# EAGLE design Routerv1.2 (EAGLE 8.3.1)

## Sheet 1 of 2
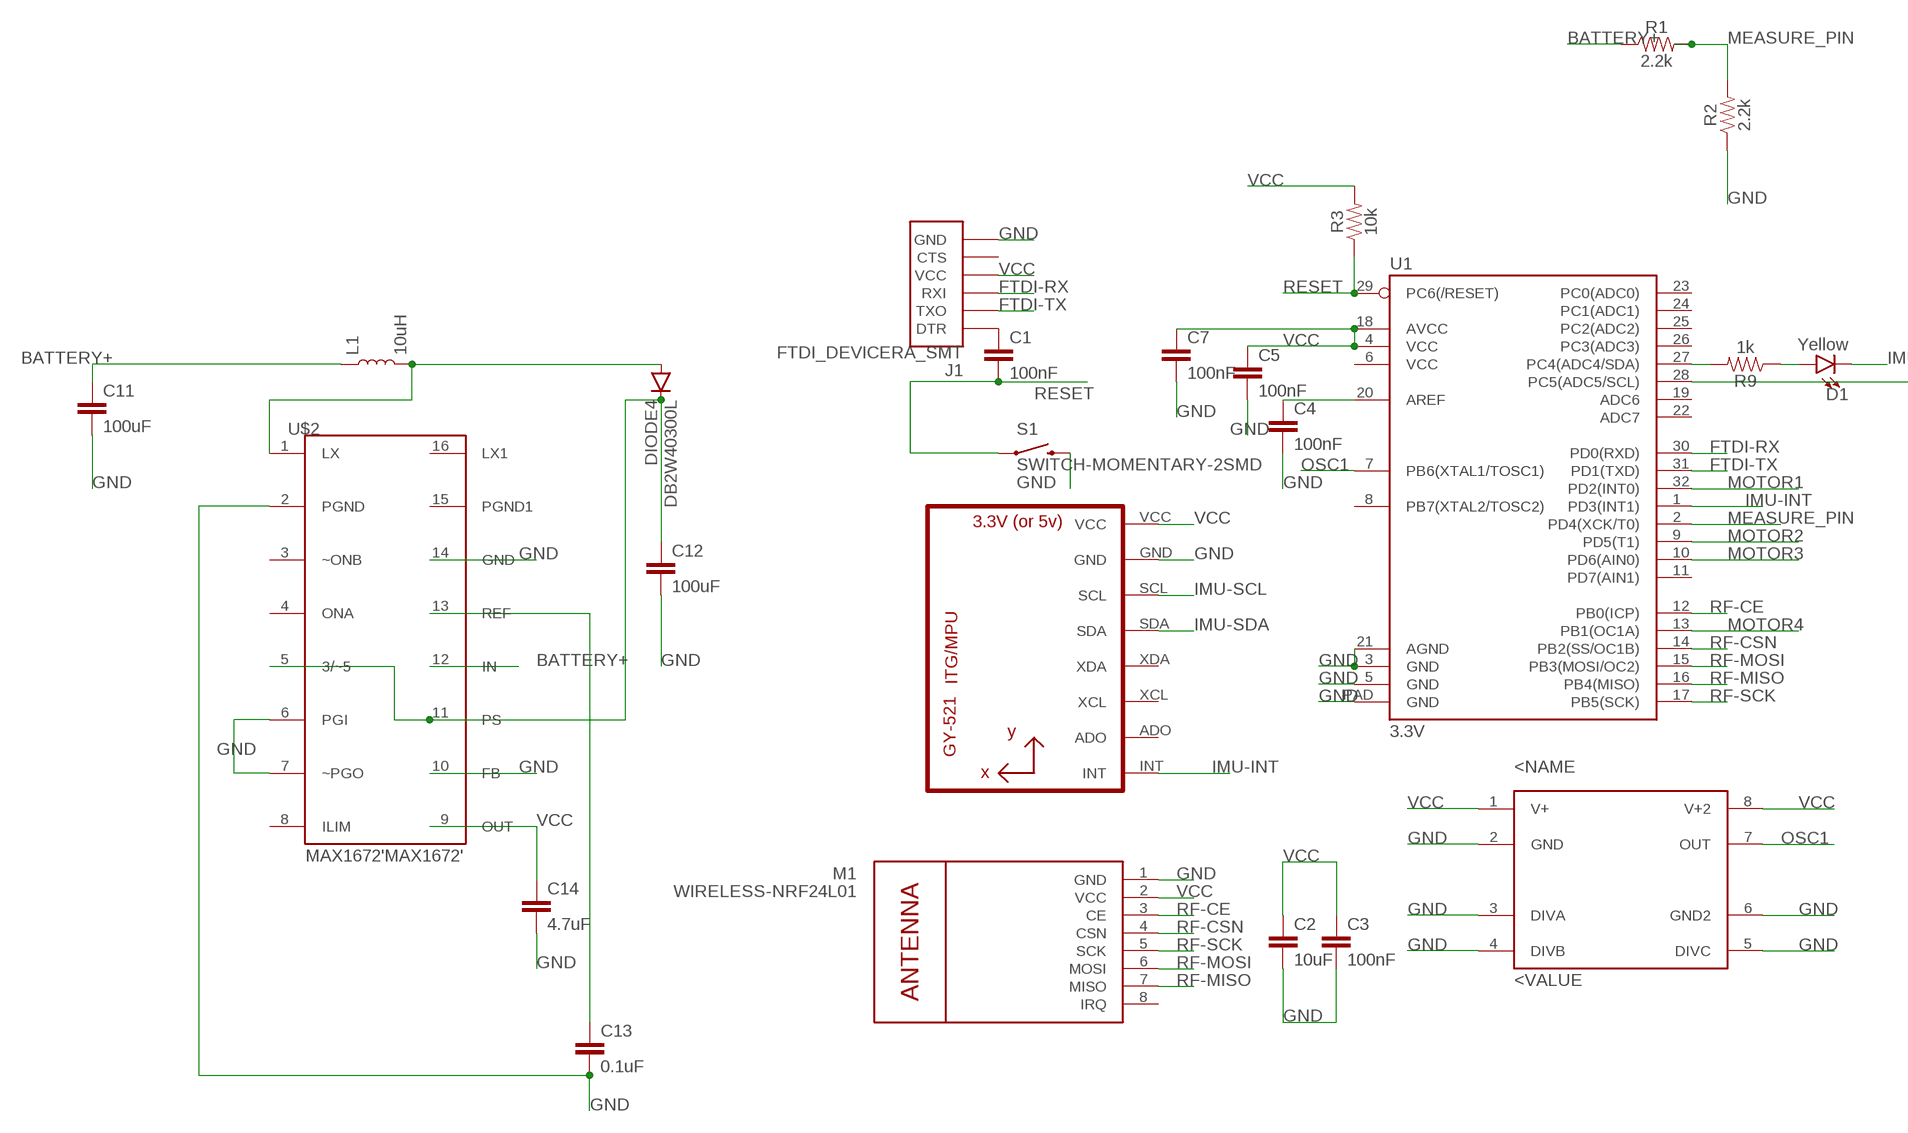
[diagram p0: schematic, sheet 1, part 1 of 2]
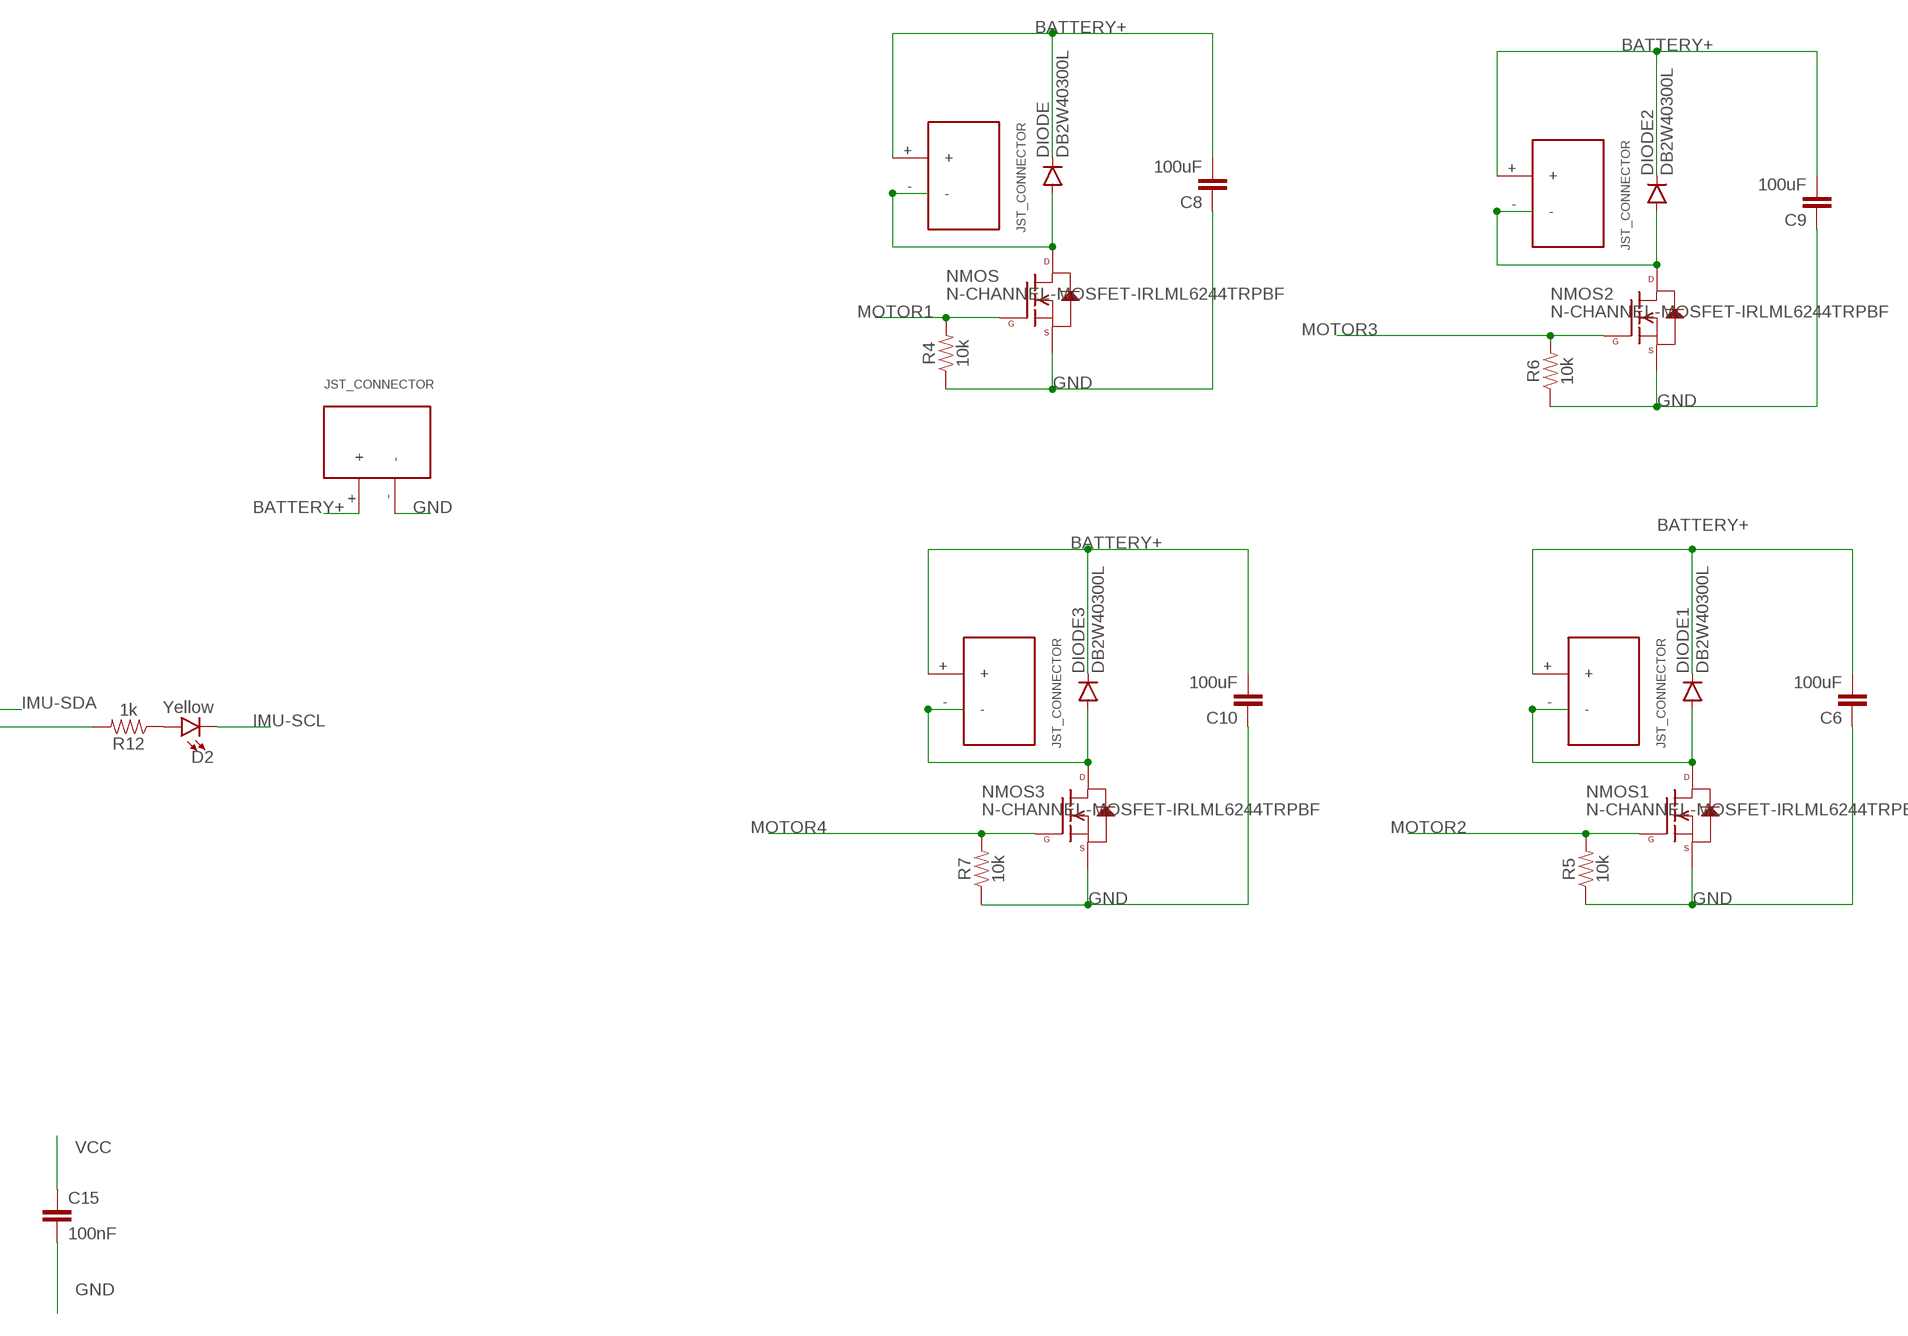
[diagram p1: schematic, sheet 1, part 2 of 2]

### Parts
C1  100nF  0.1UF-25V(+80/-20%)(0603)  [0603-CAP]
C2  10uF  CAP0603-CAP  [0603-CAP]
C3  100nF  CAP0603-CAP  [0603-CAP]
C4  100nF  CAP0603-CAP  [0603-CAP]
C5  100nF  CAP0603-CAP  [0603-CAP]
C6  100uF  CAP0603-CAP  [0603-CAP]
C7  100nF  CAP0603-CAP  [0603-CAP]
C8  100uF  CAP0603-CAP  [0603-CAP]
C9  100uF  CAP0603-CAP  [0603-CAP]
C10  100uF  CAP0603-CAP  [0603-CAP]
C11  100uF  CAP0603-CAP  [0603-CAP]
C12  100uF  CAP0603-CAP  [0603-CAP]
C13  0.1uF  CAP0603-CAP  [0603-CAP]
C14  4.7uF  CAP0603-CAP  [0603-CAP]
C15  100nF  0.1UF-25V(+80/-20%)(0603)  [0603-CAP]
D1  Yellow  LED-YELLOWLILYPAD  [LED-1206]
D2  Yellow  LED-YELLOWLILYPAD  [LED-1206]
DIODE  DB2W40300L  [MINI2-F3-B]
DIODE1  DB2W40300L  [MINI2-F3-B]
DIODE2  DB2W40300L  [MINI2-F3-B]
DIODE3  DB2W40300L  [MINI2-F3-B]
DIODE4  DB2W40300L  [MINI2-F3-B]
J1  FTDI_DEVICERA_SMT  [FTDI_DEVICE_RA_SMT]
L1  10uH  INDUCTOR-0603-33NH  [0603]
M1  WIRELESS-NRF24L01  [WIRELESS-NRF24L01]
MOTOR  JST_CONNECTOR_FEMALE  [JST_CONNECTOR_FEMALE]
MOTOR1  JST_CONNECTOR_FEMALE  [JST_CONNECTOR_FEMALE]
MOTOR2  JST_CONNECTOR_FEMALE  [JST_CONNECTOR_FEMALE]
MOTOR3  JST_CONNECTOR_FEMALE  [JST_CONNECTOR_FEMALE]
NMOS  N-CHANNEL-MOSFET-IRLML6244TRPBF  [SOT23-3]
NMOS1  N-CHANNEL-MOSFET-IRLML6244TRPBF  [SOT23-3]
NMOS2  N-CHANNEL-MOSFET-IRLML6244TRPBF  [SOT23-3]
NMOS3  N-CHANNEL-MOSFET-IRLML6244TRPBF  [SOT23-3]
R1  2.2k  2.2KOHM-0603-1/10W-1%  [0603]
R2  2.2k  2.2KOHM-0603-1/10W-1%  [0603]
R3  10k  2.2KOHM-0603-1/10W-1%  [0603]
R4  10k  2.2KOHM-0603-1/10W-1%  [0603]
R5  10k  2.2KOHM-0603-1/10W-1%  [0603]
R6  10k  2.2KOHM-0603-1/10W-1%  [0603]
R7  10k  2.2KOHM-0603-1/10W-1%  [0603]
R9  1k  2.2KOHM-0603-1/10W-1%  [0603]
R12  1k  2.2KOHM-0603-1/10W-1%  [0603]
S1  SWITCH-MOMENTARY-2SMD  [TACTILE-SWITCH-SMD]
U1  3.3V  ATMEGA328P_MLFMLF32  [MLF32-PAD]
U2  GY-521MPU6050  [GY-521]
U$1  JST_CONNECTOR_FEMALE  [JST_CONNECTOR_FEMALE]
U$2  MAX1672'MAX1672'  [21-0055H_16]
U$3  LTC6930CMS8-8.19LTC6930CMS8-8.19  [SOP65P490X110-8N]

### Nets
BATTERY+: C6.2 C8.2 C9.2 C10.2 C11.1 DIODE1.NEG(GPIN) DIODE2.NEG(GPIN) DIODE3.NEG(GPIN) DIODE.NEG(GPIN) L1.1 MOTOR1.+ MOTOR2.+ MOTOR3.+ MOTOR.+ R1.1 U$1.+ U$2.12(IN)
FTDI-RX: J1.3(RXI) U1.30(PD0(RXD))
FTDI-TX: J1.2(TXO) U1.31(PD1(TXD))
GND: C2.2 C3.2 C4.2 C5.2 C6.1 C7.2 C8.1 C9.1 C10.1 C11.2 C12.2 C13.2 C14.2 C15.2 J1.6(GND) M1.1(GND) NMOS1.2(S) NMOS2.2(S) NMOS3.2(S) NMOS.2(S) R2.1 R4.1 R5.1 R6.1 R7.1 S1.3 U1.3(GND) U1.5(GND) U1.21(AGND) U1.PAD(GND) U2.GND U$1.- U$2.2(PGND) U$2.6(PGI) U$2.7(~PGO) U$2.10(FB) U$2.14(GND) U$3.2(GND) U$3.3(DIVA) U$3.4(DIVB) U$3.5(DIVC) U$3.6(GND2)
IMU-INT: U1.1(PD3(INT1)) U2.INT
IMU-SCL: D2.C U2.SCL
IMU-SDA: D1.C U2.SDA
MEASURE_PIN: R1.2 R2.2 U1.2(PD4(XCK/T0))
MOTOR1: NMOS.1(G) R4.2 U1.32(PD2(INT0))
MOTOR2: NMOS1.1(G) R5.2 U1.9(PD5(T1))
MOTOR3: NMOS2.1(G) R6.2 U1.10(PD6(AIN0))
MOTOR4: NMOS3.1(G) R7.2 U1.13(PB1(OC1A))
N$1: DIODE4.POS(PPIN) L1.2 U$2.1(LX)
N$2: C4.1 U1.20(AREF)
N$3: R9.2 U1.27(PC4(ADC4/SDA))
N$4: DIODE1.POS(PPIN) MOTOR1.- NMOS1.3(D)
N$5: DIODE2.POS(PPIN) MOTOR2.- NMOS2.3(D)
N$6: DIODE.POS(PPIN) MOTOR.- NMOS.3(D)
N$7: DIODE3.POS(PPIN) MOTOR3.- NMOS3.3(D)
N$8: D1.A R9.1
N$9: D2.A R12.1
N$10: R12.2 U1.28(PC5(ADC5/SCL))
N$13: C1.1 J1.1(DTR)
OSC1: U1.7(PB6(XTAL1/TOSC1)) U$3.7(OUT)
RESET: C1.2 R3.1 S1.1 U1.29(PC6(/RESET))
RF-CE: M1.3(CE) U1.12(PB0(ICP))
RF-CSN: M1.4(CSN) U1.14(PB2(SS/OC1B))
RF-MISO: M1.7(MISO) U1.16(PB4(MISO))
RF-MOSI: M1.6(MOSI) U1.15(PB3(MOSI/OC2))
RF-SCK: M1.5(SCK) U1.17(PB5(SCK))
VCC: C2.1 C3.1 C5.1 C7.1 C14.1 C15.1 J1.4(VCC) M1.2(VCC) R3.2 U1.4(VCC) U1.18(AVCC) U2.VCC U$2.9(OUT) U$3.1(V+) U$3.8(V+2)
VR-PS: C12.1 DIODE4.NEG(GPIN) U$2.5(3/~5) U$2.11(PS)
VR-REF: C13.1 U$2.13(REF)
Unconnected: J1.5(CTS) M1.8(IRQ) U1.6(VCC) U1.8(PB7(XTAL2/TOSC2)) U1.11(PD7(AIN1)) U1.19(ADC6) U1.22(ADC7) U1.23(PC0(ADC0)) U1.24(PC1(ADC1)) U1.25(PC2(ADC2)) U1.26(PC3(ADC3)) U2.ADO U2.XCL U2.XDA U$2.3(~ONB) U$2.4(ONA) U$2.8(ILIM) U$2.15(PGND1) U$2.16(LX1)

## Sheet 2 of 2

## Library data of the parts
C1 C15 = SparkFun-Capacitors:0.1UF-25V(+80/-20%)(0603): CAP-00810 Ceramic Standard decoupling cap; PROD_ID: CAP-00810; VALUE: 0.1uF
C2-C14 = SparkFun-Passives:CAP: Capacitor Standard 0603 ceramic capacitor, and 0.1" leaded capacitor.
D1 D2 = SparkFun-LED:LED-YELLOW: Yellow SMD LED Used in manufacturing several products at SparkFun. Packages: 0603 - SMD 0603 package[Product Link] <http://www.kingbrightusa.com/product.asp?catalog_name=LED&product_id=APT1608SYCK> 0603 -SMART - SMART SMD 0603 package (more efficient/more expensive) [Product Link] <http://www.osram-os.com/osram_os/en/products/product-catalog/led-light-emitting-diodes/smartled-0603/ly-l29k/index.jsp> LilyPad - SMD1206 package[Product Datasheet] <https://www.sparkfun.com/datasheets/DevTools/LilyPad/Q150YUS4.pdf> SparkFun Products: Blynk Board <https://www.sparkfun.com/products/13794> IOIO-OTG <https://www.sparkfun.com/products/13613> XBee Explorer Serial <https://www.sparkfun.com/products/13225>; PROD_ID: DIO-09909
DIODE DIODE1-DIODE4 = quad:DB2W40300L
J1 = quad:FTDI_DEVICE: Connector which mates to FTDI basic or FTDI cable.; PROD_ID: CONN-08971
L1 = SparkFun-Coils:INDUCTOR: Inductors Resist changes in electrical current. Basically a coil of wire. SparkFun Products: SparkFun Load Cell Amplifier - HX711 <https://www.sparkfun.com/products/13879> IOIO-OTG - V2.2 <https://www.sparkfun.com/products/13613>; PROD_ID: NDUC-07874; VALUE: 33nH/±5%/500mA
M1 = quad:WIRELESS-NRF24L01: 2.4 GHz Wireless Module based on NRF24L01 chip
MOTOR MOTOR1-MOTOR3 U$1 = quad:JST_CONNECTOR_FEMALE
NMOS NMOS1-NMOS3 = quad:N-CHANNEL-MOSFET: N-Channel MOSFET Mode Field Effect Transistor; DATASHEET: http://www.mouser.com/ds/2/196/irlml6244pbf-936666.pdf; MOUSER: 942-IRLML6244TRPBF; URL: http://www.mouser.com/Search/ProductDetail.aspx?R=IRLML6244TRPBFvirtualkey57370000virtualkey942-IRLML6244TRPBF
R1 R2 = SparkFun-Resistors:2.2KOHM: 2.2kΩ resistor A resistor is a passive two-terminal electrical component that implements electrical resistance as a circuit element. Resistors act to reduce current flow, and, at the same time, act to lower voltage levels within circuits. - Wikipedia; PROD_ID: RES-08272
R3-R7 R9 R12 = SparkFun-Resistors:2.2KOHM: 2.2kΩ resistor A resistor is a passive two-terminal electrical component that implements electrical resistance as a circuit element. Resistors act to reduce current flow, and, at the same time, act to lower voltage levels within circuits. - Wikipedia; PROD_ID: RES-08272; VALUE: 2.2k
S1 = quad:SWITCH-MOMENTARY-2: Various NO switches- pushbuttons, reed, etc; PROD_ID: SWCH-08247
U1 = SparkFun-DigitalIC:ATMEGA328P_MLF: 32-Pin Atmega328 part Commonly used on Arduino compatible boards Available in QFP and QFN packages TQFP is IC-09069 QFN is non-stock
U2 = quad:GY-521
U$2 = voltreg:MAX1672
U$3 = LTC6390:LTC6930CMS8-8.19

## Board
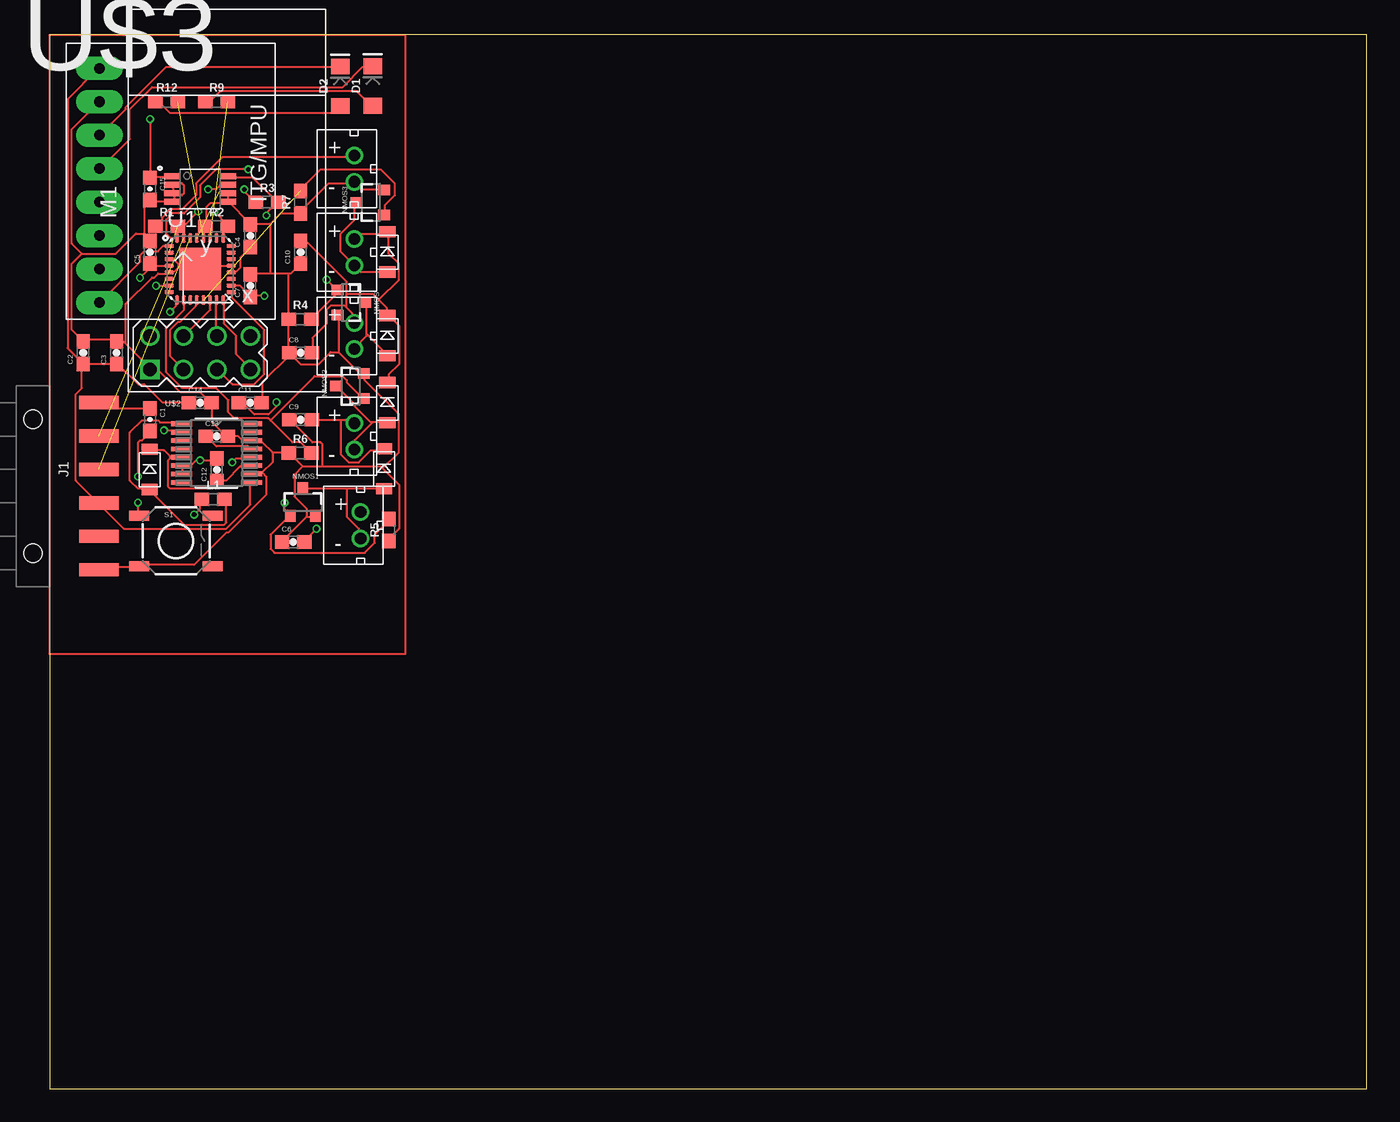
[diagram p2: board, top side]
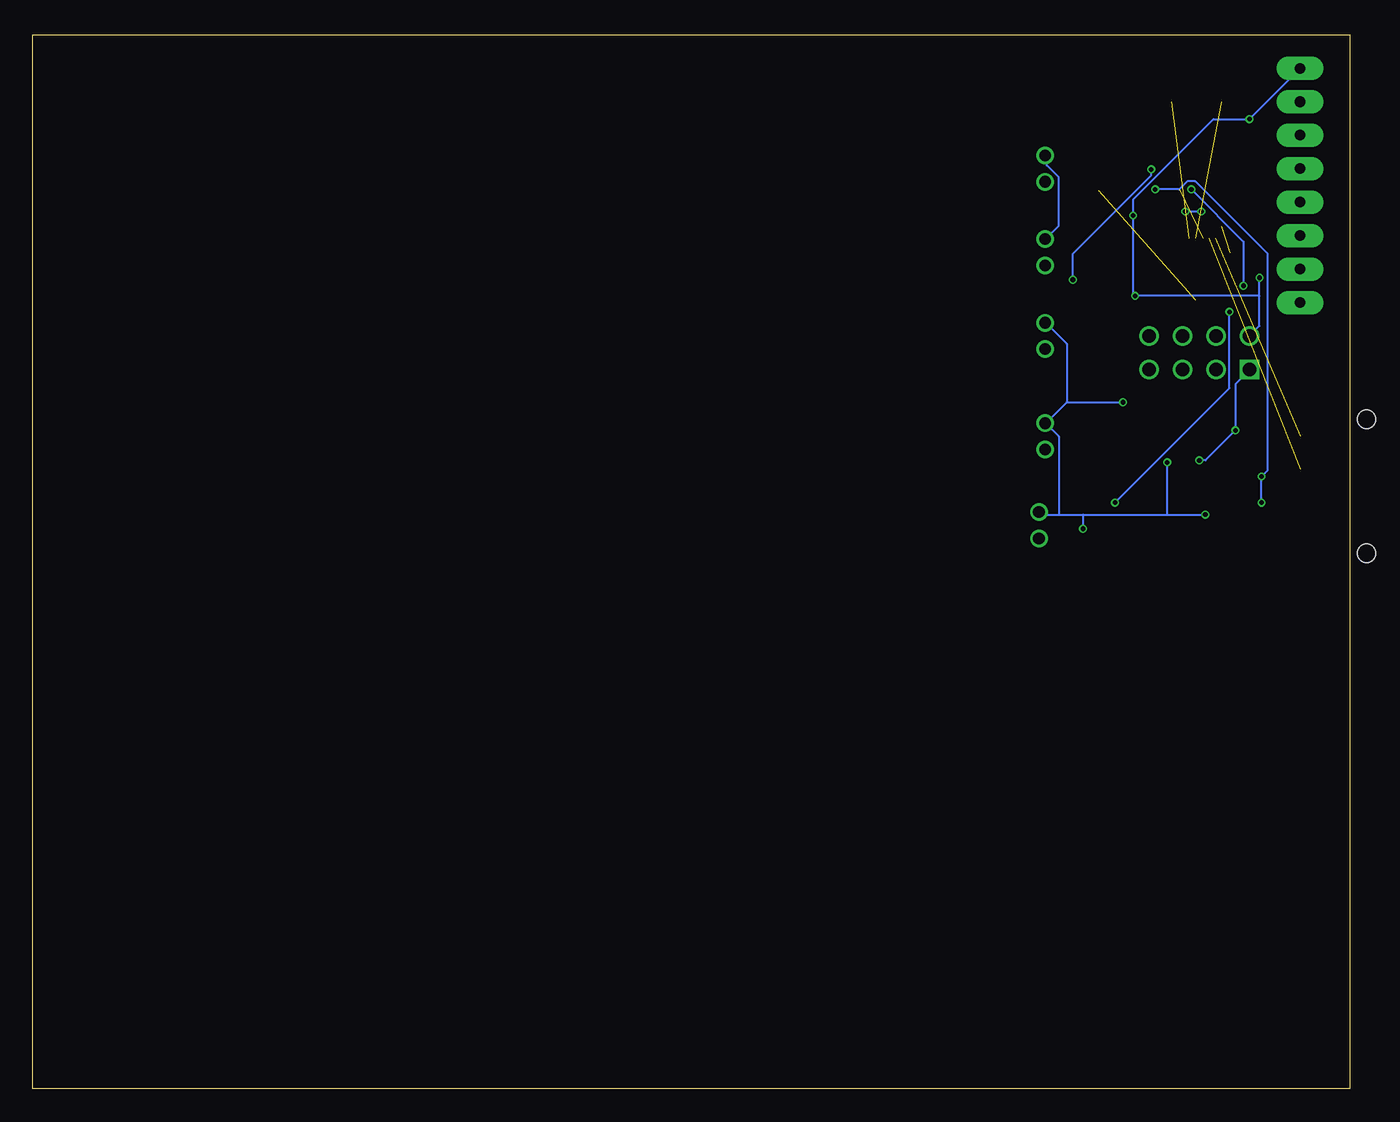
[diagram p3: board, bottom side, seen from below]

Size 100 x 80 mm. Coordinates in mm from the lower left corner, seen from the top.
Outline: 0,0 100,0 100,80 0,80 0,0
Copper layers (1*16): Top 0.035559375mm / dielectric 1.6mm / Bottom 0.035559375mm
Design rules "oshpark-2layer": minimum track width 6mil, minimum drill 10mil, track to track 6mil, track to pad 6mil, pad to pad 6mil, via to via 6mil, smd to smd 6mil, copper to edge 15mil, drill to drill 6mil, minimum pad ring 5mil, minimum via ring 5mil, stop-mask expansion 2.5mil, vias tented up to drill 0mil, thermal gap 10mil

### Footprints (pad centres in the part's own frame; a part is rotated, then mirrored left to right if it is on the bottom)
0603-CAP = smd 1.1 x 1: 1 -0.85,0; 2 0.85,0
LED-1206 = smd 1.2 x 1.4: A -1.5,0; C 1.5,0
MINI2-F3-B = smd 1.22 x 0.85: NEG 0,1.55; POS 0,-1.5
FTDI_DEVICE_RA_SMT = smd 1 x 3: 1 -6.35,5; 2 -3.81,5; 3 -1.27,5; 4 1.27,5; 5 3.81,5; 6 6.35,5 | hole 1.4: -5.08,0; 5.08,0
0603 = smd 1.1 x 1: 1 -0.85,0; 2 0.85,0
WIRELESS-NRF24L01 = drill 1 square: 1 -12.7,6.35 | drill 1: 2 -10.16,6.35; 3 -12.7,3.81; 4 -10.16,3.81; 5 -12.7,1.27; 6 -10.16,1.27; 7 -12.7,-1.27; 8 -10.16,-1.27
JST_CONNECTOR_FEMALE = drill 0.889: + 0,1; - 0,-1
SOT23-3 = smd 0.8 x 0.9: 1 -0.95,-1; 2 0.95,-1; 3 0,1.1
TACTILE-SWITCH-SMD = smd 1.524 x 0.762: 1 -2.794,1.905; 2 2.794,1.905; 3 -2.794,-1.905; 4 2.794,-1.905
MLF32-PAD = smd 0.7 x 0.3: 1 -2.35,1.75; 2 -2.35,1.25; 3 -2.35,0.75; 4 -2.35,0.25; 5 -2.35,-0.25; 6 -2.35,-0.75; 7 -2.35,-1.25; 8 -2.35,-1.75; 17 2.35,-1.75; 18 2.35,-1.25; 19 2.35,-0.75; 20 2.35,-0.25; 21 2.35,0.25; 22 2.35,0.75; 23 2.35,1.25; 24 2.35,1.75 | smd 0.3 x 0.7: 9 -1.75,-2.35; 10 -1.25,-2.35; 11 -0.75,-2.35; 12 -0.25,-2.35; 13 0.25,-2.35; 14 0.75,-2.35; 15 1.25,-2.35; 16 1.75,-2.35; 25 1.75,2.35; 26 1.25,2.35; 27 0.75,2.35; 28 0.25,2.35; 29 -0.25,2.35; 30 -0.75,2.35; 31 -1.25,2.35; 32 -1.75,2.35 | smd 3.2 x 3.2: PAD 0,0
GY-521 = drill 0.8 pad 1.778 long: ADO -8.89,-6.35; GND -8.89,6.35; INT -8.89,-8.89; SCL -8.89,3.81; SDA -8.89,1.27; VCC -8.89,8.89; XCL -8.89,-3.81; XDA -8.89,-1.27
21-0055H_16 = smd 1.6 x 0.356: 1 -2.654,2.223; 2 -2.654,1.587; 3 -2.654,0.953; 4 -2.654,0.318; 5 -2.654,-0.318; 6 -2.654,-0.953; 7 -2.654,-1.587; 8 -2.654,-2.223; 9 2.654,-2.223; 10 2.654,-1.587; 11 2.654,-0.953; 12 2.654,-0.318; 13 2.654,0.318; 14 2.654,0.953; 15 2.654,1.587; 16 2.654,2.223
SOP65P490X110-8N = smd 1.25 x 0.46: 1 -2.11,0.975; 2 -2.11,0.325; 3 -2.11,-0.325; 4 -2.11,-0.975; 5 2.11,-0.975; 6 2.11,-0.325; 7 2.11,0.325; 8 2.11,0.975

### Placement (x,y rotation side)
C1  7.62,50.8 270 top
C2  2.54,55.88 90 top
C3  5.08,55.88 90 top
C4  15.24,64.77 90 top
C5  7.62,63.5 90 top
C6  18.5,41.51 0 top
C7  15.24,60.96 90 top
C8  19.05,55.88 0 top
C9  19.05,50.8 0 top
C10  19.05,63.5 90 top
C11  15.21,52.07 0 top
C12  12.7,46.99 90 top
C13  12.7,49.53 0 top
C14  11.43,52.07 0 top
C15  7.62,68.31 270 top
D1  24.53,76.13 90 top
D2  22.07,76.1 90 top
DIODE  25.64,57.15 0 top
DIODE1  25.39,47.05 0 top
DIODE2  25.64,52.07 0 top
DIODE3  25.64,63.5 0 top
DIODE4  7.59,46.99 0 top
J1  -1.27,45.75 270 top
L1  12.43,44.75 0 top
M1  13.97,67.31 90 top
MOTOR  23.13,57.15 0 top
MOTOR1  23.61,42.78 0 top
MOTOR2  23.13,49.53 0 top
MOTOR3  23.13,63.5 0 top
NMOS  22.86,59.69 270 top
NMOS1  19.23,44.51 0 top
NMOS2  22.86,53.34 90 top
NMOS3  24.4,67.28 90 top
R1  8.89,65.47 0 top
R2  12.67,65.47 0 top
R3  16.51,67.31 0 top
R4  19.02,58.42 0 top
R5  25.76,42.42 90 top
R6  19.02,48.26 0 top
R7  19.05,67.31 90 top
R9  12.67,74.93 0 top
R12  8.89,74.93 0 top
S1  9.59,41.59 0 top
U1  11.43,62.23 0 top
U2  12.67,68.58 0 top
U$1  23.13,69.85 0 top
U$2  12.67,48.26 0 top
U$3  11.43,68.31 0 top

### Tracks (layer width: path | path; a pad name or v marks a point on that pad's centre or on a via)
BATTERY+  (via drill 0.35)
  Top 0.152: R1.1 8.08,65.53 8.53,65.99 8.53,66.14 9.14,66.75 10.06,66.75 11.12,67.82 11.12,68.73 13.11,70.71 23.01,70.71 U$1.+ | v10.97,43.59 11.43,44.04 11.43,44.65 L1.1 | v20.27,42.52 19.36,41.6 C6.2 | v13.87,47.55 14.17,47.85 15.24,47.85 U$2.12 | v17.22,52.12 17.22,51.82 16.61,51.21 15.54,51.21 14.78,51.97 14.48,51.97 C11.1 | 22.1,50.75 22.86,50.75 23.01,50.6 MOTOR2.+ | 22.1,50.75 19.96,50.75 C9.2 | 22.1,50.75 22.1,48.16 22.71,47.55 23.47,47.55 24.38,48.46 25.3,48.46 DIODE1.NEG | MOTOR3.+ 23.16,64.62 23.47,64.92 25.6,64.92 DIODE3.NEG 25.76,64.92 25.76,63.4 26.52,62.64 26.52,61.42 24.99,59.89 | DIODE2.NEG 25.76,53.65 25.76,54.25 26.52,55.02 26.52,57.91 25.76,58.67 DIODE.NEG 25.6,58.83 25.6,59.28 24.99,59.89 | 22.55,59.28 23.01,58.83 23.01,58.22 MOTOR.+ | 22.55,59.28 22.4,59.44 21.34,59.44 21.03,59.13 21.03,58.06 19.96,57 19.96,55.93 C8.2 | 22.55,59.28 22.55,60.35 | 22.55,60.35 22.55,61.27 19.51,64.31 19.05,64.31 C10.2 | 24.99,59.89 24.54,60.35 22.55,60.35
  Bottom 0.152: 22.1,43.59 23.32,43.59 23.47,43.74 MOTOR1.+ | 22.1,43.59 20.27,43.59 | 20.27,43.59 13.87,43.59 | 13.87,43.59 v10.97,43.59 | 20.27,43.59 v20.27,42.52 | 13.87,43.59 v13.87,47.55 | 21.49,52.12 v17.22,52.12 | 21.49,52.12 23.01,50.6 MOTOR2.+ 23.01,50.44 22.1,49.53 22.1,43.59 | 21.49,52.12 21.49,56.54 23.01,58.06 MOTOR.+ | MOTOR3.+ 22.1,65.53 22.1,69.19 23.01,70.1 23.01,70.71 U$1.+
FTDI-RX  (1 unrouted)
FTDI-TX  (1 unrouted)
GND  (via drill 0.35)
  Top 0.152: 9.97,68.74 10.04,68.74 10.17,68.61 10.17,67.96 10.04,67.83 9.51,67.83 9.44,68.12 | 9.44,68.12 U$3.2 | 9.75,62.33 9.45,62.03 9.14,62.03 U1.5 8.99,61.87 8.23,61.87 7.92,61.57 7.77,61.57 5.79,59.59 5.79,56.54 | 9.75,62.33 9.75,62.64 9.45,62.94 9.14,62.94 U1.3 | 11.43,62.33 11.58,62.48 13.72,62.48 U1.21 | 11.43,62.33 9.75,62.33 | 11.43,62.33 U1.PAD | 9.44,68.12 9.45,68.12 U$3.3 9.45,67.82 9.45,67.36 U$3.4 9.3,67.36 7.62,67.36 | 7.16,64.92 7.62,64.47 C5.2 | 7.16,64.92 7.16,66.9 7.62,67.36 | 7.62,67.36 C15.2 | C12.2 12.65,47.7 v11.43,47.7 11.12,47.7 10.82,47.4 10.06,47.4 U$2.6 10.06,47.24 10.06,46.79 U$2.7 | v8.69,49.99 9.91,49.99 U$2.2 | 5.79,56.54 7.62,54.71 M1.1 7.62,54.56 8.23,54.56 9.91,52.88 11.43,52.88 12.19,52.12 C14.2 12.34,51.97 12.34,50.6 13.41,49.53 C13.2 14.33,49.53 14.63,49.23 15.24,49.23 U$2.14 15.39,49.07 16.15,49.07 16.92,48.31 | 5.79,56.54 5.64,56.69 5.18,56.69 C3.2 5.03,56.84 2.59,56.84 C2.2 2.44,56.84 1.68,57.61 1.68,62.64 2.44,63.4 | 7.16,64.92 6.55,64.92 5.03,63.4 2.44,63.4 | 2.44,63.4 1.68,64.16 1.68,72.85 3.66,74.83 U2.GND | NMOS3.2 25.3,68.28 23.62,68.28 23.16,68.73 U$1.- 23.01,68.73 21.18,68.73 19.05,66.6 R7.1 19.05,66.45 17.53,66.45 16.76,65.68 | R2.1 11.89,65.53 11.89,66.9 12.19,67.21 13.41,67.21 U$3.5 13.56,67.36 | 13.56,67.36 15.24,65.68 | 15.24,65.68 16.76,65.68 | 15.24,65.68 C4.2 | 13.56,67.36 13.56,67.97 U$3.6 | 21.95,55.93 23.47,54.41 23.77,54.41 NMOS2.2 23.93,54.25 23.93,53.8 26.52,51.21 26.52,48.31 25.3,47.09 | 21.95,55.93 21.95,58.67 NMOS.2 | 18.14,61.87 18.29,61.87 19.05,62.64 C10.1 | 18.14,61.87 16.76,61.87 | 16.76,61.87 15.24,61.87 C7.2
  Top 0.152: 18.29,55.78 16.15,53.65 16.15,52.12 C11.2 | 18.14,61.87 18.14,58.52 R4.1 18.14,58.37 18.14,55.93 C8.1 18.29,55.78 | 21.95,55.93 21.34,55.93 20.42,55.02 19.05,55.02 18.29,55.78 | 16.76,61.87 16.76,65.68 | J1.6 3.81,39.47 3.96,39.62 6.71,39.62 S1.3 6.86,39.78 10.97,39.78 13.41,42.22 13.56,42.22 16.46,45.11 16.46,46.48 16.15,46.79 | 19.51,43.43 20.12,43.43 NMOS1.2 | 19.51,43.43 17.68,41.6 C6.1 | 16.92,48.31 18.14,48.31 R6.1 18.29,48.16 19.2,47.24 | 25.3,47.09 25.15,47.24 20.73,47.24 | 25.3,47.09 26.52,45.87 26.52,42.52 25.91,41.91 25.91,41.6 R5.1 | 19.2,47.24 20.73,47.24 | 20.73,47.24 20.73,48.92 20.57,49.07 19.96,49.07 18.29,50.75 C9.1 | 16.15,46.79 15.39,46.79 U$2.10 | 16.15,46.79 16.92,47.55 16.92,48.31 | 19.51,43.43 19.51,44.04 18.59,44.96 18.59,46.63 19.2,47.24
  Bottom 0.152: M1.1 7.62,54.56 8.69,53.49 v8.69,49.99 10.97,47.7 v11.43,47.7
IMU-INT
  Top 0.152: U2.INT 6.89,62.8 6.89,63.3 7.17,63.57 8.21,63.57 8.62,63.98 U1.1
IMU-SCL
  Top 0.152: D2.C 21.95,77.57 8.84,77.57 5.79,74.52 5.79,74.37 3.81,72.39 U2.SCL
IMU-SDA
  Top 0.152: D1.C 24.38,77.57 23.77,77.57 22.25,76.05 7.77,76.05 6.1,74.37 6.1,72.08 3.81,69.8 U2.SDA
MEASURE_PIN  (via drill 0.35)  (1 unrouted)
  Top 0.152: v11.28,66.6 10.21,65.53 9.75,65.53 R1.2 | v12.5,66.6 13.56,65.53 R2.2
  Bottom 0.152: v12.5,66.6 v11.28,66.6
MOTOR1  (via drill 0.35)
  Top 0.152: v15.09,69.8 12.65,69.8 11.43,68.58 11.43,67.67 10.21,66.45 9.3,66.45 8.84,65.99 8.84,64.92 9.14,64.62 9.6,64.62 U1.32 | v21.03,61.42 21.79,60.66 NMOS.1 21.95,60.5 19.96,58.52 R4.2
  Bottom 0.152: v15.09,69.8 15.09,69.34 21.03,63.4 v21.03,61.42
MOTOR2  (via drill 0.35)
  Top 0.152: v9.14,58.98 9.6,59.44 9.6,59.74 U1.9 | v17.83,44.5 17.83,43.89 18.14,43.59 NMOS1.1 18.14,43.43 16.76,42.06 16.76,41 17.07,40.69 23.93,40.69 24.69,41.45 24.69,42.06 25.76,43.13 R5.2
  Bottom 0.152: v9.14,58.98 9.14,53.19 v17.83,44.5
MOTOR3
  Top 0.152: 16.76,50.75 18.44,49.07 19.05,49.07 19.81,48.31 R6.2 | 16.76,50.75 16.61,50.9 14.02,50.9 13.56,51.36 13.56,52.27 12.65,53.19 10.06,53.19 8.84,54.41 8.84,57.76 10.21,59.13 10.21,59.74 U1.10 | 16.76,50.75 20.12,54.1 22.25,54.1 22.55,53.8 22.55,53.65 23.77,52.43 NMOS2.1
MOTOR4  (1 unrouted)
  Top 0.152: NMOS3.1 25.45,66.45 25.45,67.06 26.21,67.82 26.21,68.73 25.15,69.8 20.57,69.8 19.05,68.28 R7.2
N$1
  Top 0.152: L1.2 13.41,44.65 13.41,42.98 13.26,42.82 10.21,42.82 7.62,45.41 DIODE4.POS 7.47,45.57 6.71,45.57 6.1,46.18 6.1,49.84 7.01,50.75 8.23,50.75 8.38,50.6 9.91,50.6 U$2.1
N$2
  Top 0.152: U1.20 13.87,62.03 14.17,62.03 14.48,62.33 14.48,63.09 15.24,63.86 C4.1
N$3  (1 unrouted)
N$4
  Top 0.152: 22.55,45.57 25.3,45.57 DIODE1.POS | 22.55,45.57 19.36,45.57 NMOS1.3 | 22.55,45.57 22.55,43.43 23.47,42.52 23.47,41.91 MOTOR1.-
N$5
  Top 0.152: 24.54,50.6 25.6,50.6 DIODE2.POS | 24.54,50.6 24.38,50.6 23.16,51.82 23.16,51.97 21.79,53.34 NMOS2.3 | 24.54,50.6 23.16,49.23 23.16,48.62 MOTOR2.-
N$6
  Top 0.152: 24.08,57.3 24.08,57.15 23.16,56.24 MOTOR.- | 24.08,57.3 24.08,59.59 NMOS.3 | 24.08,57.3 25.6,55.78 DIODE.POS
N$7
  Top 0.152: NMOS3.3 23.16,67.21 23.16,65.99 22.1,64.92 22.1,63.55 23.01,62.64 MOTOR3.- 23.16,62.48 23.62,62.03 25.6,62.03 DIODE3.POS
N$8
  Top 0.152: R9.1 11.89,74.98 12.19,74.98 12.95,75.74 23.32,75.74 24.38,74.68 D1.A
N$9
  Top 0.152: R12.1 8.08,74.83 8.38,74.83 9.14,74.07 21.49,74.07 21.95,74.52 D2.A
N$10  (1 unrouted)
N$11
  Top 0.152: 27,80 27,33 0,33 0,80 27,80
N$13
  Top 0.152: C1.1 7.62,51.66 4.12,51.66 3.81,51.97 J1.1
OSC1  (via drill 0.35)
  Top 0.152: v8.08,60.96 8.99,60.96 U1.7 | v12.04,68.28 12.65,68.28 12.95,68.58 13.41,68.58 U$3.7
  Bottom 0.152: v8.08,60.96 8.08,64.31 v12.04,68.28
RESET  (via drill 0.35)  (1 unrouted)
  Top 0.152: v6.71,46.48 6.71,49.07 6.86,49.23 7.01,49.23 7.62,49.84 C1.2 | v6.71,44.5 6.71,43.59 S1.1 | v14.78,68.28 14.78,68.12 15.54,67.36 R3.1
  Bottom 0.152: v6.71,44.5 v6.71,46.48 6.25,46.94 6.25,63.4 11.73,68.89 12.34,68.89 12.95,68.28 v14.78,68.28
RF-CE
  Top 0.152: M1.3 9.14,55.63 9.14,57.61 9.75,58.22 9.91,58.22 11.12,59.44 11.12,59.74 U1.12
RF-CSN
  Top 0.152: U1.14 12.19,59.74 12.19,59.13 10.21,57.15 M1.4
RF-MISO
  Top 0.152: U1.16 13.26,59.74 13.26,58.06 14.17,57.15 14.17,55.78 15.24,54.71 M1.7
RF-MOSI
  Top 0.152: U1.15 12.65,59.74 12.65,57.15 M1.6
RF-SCK
  Top 0.152: U1.17 13.87,60.35 13.87,60.05 16.31,57.61 16.31,54.25 15.54,53.49 13.87,53.49 12.8,54.56 M1.5
VCC  (via drill 0.35)
  Top 0.152: C2.1 2.59,55.02 5.03,55.02 C3.1 5.18,55.02 6.71,53.49 7.16,53.49 8.53,52.12 10.52,52.12 C14.1 | U$2.9 15.24,46.02 15.24,44.35 13.41,42.52 5.64,42.52 3.81,44.35 J1.4 3.66,44.5 1.98,46.18 1.98,52.73 2.44,53.19 2.44,55.02 C2.1 | 7.62,69.19 9.3,69.19 U$3.1 | v7.62,73.61 7.62,69.19 | 7.62,69.19 C15.1 | U$3.8 13.56,69.19 15.39,69.19 17.22,67.36 R3.2 17.22,67.21 16.46,66.45 v16.46,66.29 | 15.24,60.2 14.48,60.96 13.87,60.96 U1.18 | 7.77,62.48 8.99,62.48 U1.4 | 7.77,62.48 7.62,62.64 C5.1 7.77,62.48 | v6.86,61.57 7.77,62.48 | v16.31,60.2 15.24,60.2 | 15.24,60.2 C7.1 | C2.1 2.44,55.17 1.37,56.24 1.37,75.13 3.66,77.42 U2.VCC
  Bottom 0.152: U2.VCC 3.81,77.42 v7.62,73.61 10.36,73.61 16.46,67.51 v16.46,66.29 16.46,60.35 v16.31,60.2 6.86,60.2 | 6.86,60.2 6.86,57.91 M1.2 | 6.86,60.2 v6.86,61.57
VR-PS
  Top 0.152: 9.14,48.01 8.69,48.46 7.62,48.46 DIODE4.NEG | 9.14,48.01 9.91,48.01 U$2.5 | U$2.11 15.24,47.24 14.48,47.24 13.41,46.18 12.8,46.18 C12.1 12.65,46.02 12.19,45.57 9.14,45.57 8.99,45.72 8.99,47.7 9.14,47.85 9.14,48.01
VR-REF
  Top 0.152: C13.1 11.89,49.53 12.65,48.77 15.09,48.77 15.24,48.62 U$2.13